# Altium schematic sheet autres_ressouces_schéma.SchDoc
size A3
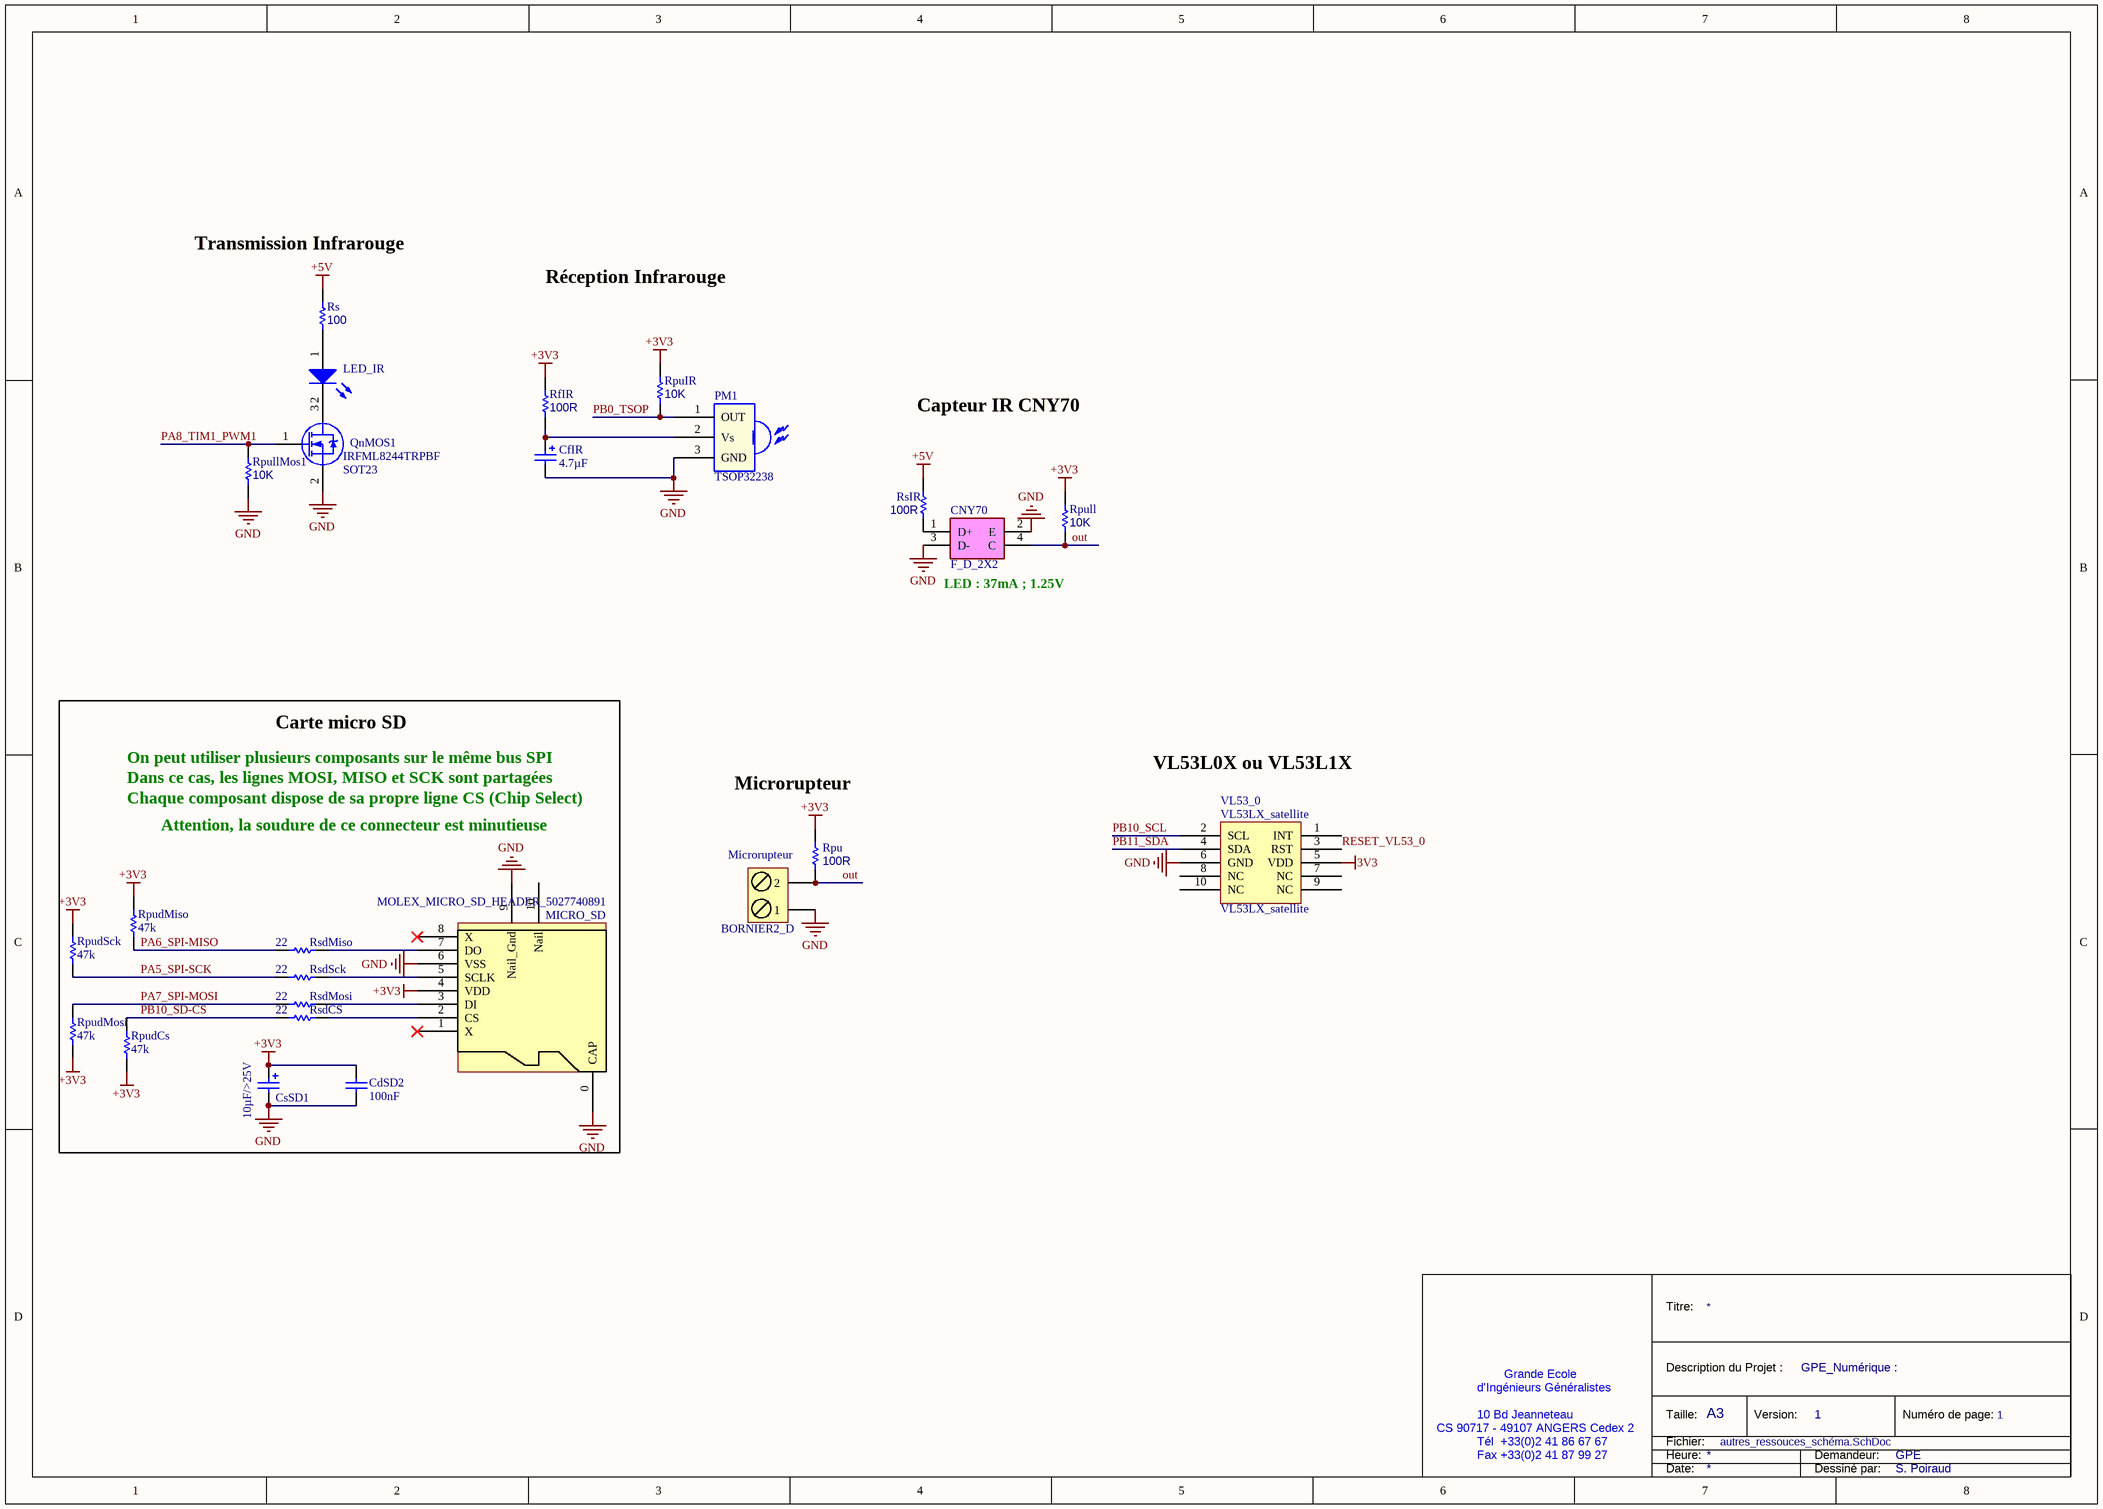
[diagram p0: autres_ressouces_schéma.SchDoc]

## Parts
CdSD2  100nF  [CONDENSATEUR_CERAMIQUE_RADIAL_5.08]
CfIR  value 4.7µF  [CONDENSATEUR_POLARISE_ELECTROLYTIQUE_RADIAL_2.0/5.08]  (hidden comment: CONDENSATEUR_POL_ELECTROLY_RAD_2.0/5.08)
CNY70  Type: F_D_2X2  [BARRETTE_2X2_F_D]  (hidden comment: BARRETTE 2 CONTACTS 2 RANGEES FEMELLE DROITE)
CsSD1  value 10µF/>25V  [CONDENSATEUR_POLARISE_ELECTROLYTIQUE_RADIAL_2.0/5.08]  (hidden comment: CONDENSATEUR_POL_ELECTROLY_RAD_2.0/5.08)
D2  Type: LED_IR  [LED_3MM]  (hidden comment: LED_3MM)
MICRO_SD  MOLEX_MICRO_SD_HEADER_5027740891  [MOLEX_MICRO_SD_HEADER_5027740891]
Microrupteur  Type: BORNIER2_D  [BORNIER2_A_VIS]  (hidden comment: BORNIER2 DROIT A VIS)
PM1  Type: TSOP32238  [RECEPTEUR_INFRAROUGE_TSOP32238]  (hidden comment: RECEPTEUR_INFRAROUGE_TSOP32238)
QnMOS1  Type: IRFML8244TRPBF  Package: SOT23  [TRANSISTOR_MOSFET-N_SOT23_GSD]  (hidden comment: TRANSISTOR_MOSFET-N_SOT23_GSD)
RfIR  value 100R  [RESISTANCE_1/4W]  (hidden comment: RESISTANCE_AXIALE_1/4W)
Rpu  value 100R  [RESISTANCE_1/4W]  (hidden comment: RESISTANCE_AXIALE_1/4W)
RpudCs  47k  [RESISTANCE_1/4W]
RpudMiso  47k  [RESISTANCE_1/4W]
RpudMosi  47k  [RESISTANCE_1/4W]
RpudSck  47k  [RESISTANCE_1/4W]
RpuIR  value 10K  [RESISTANCE_1/4W]  (hidden comment: RESISTANCE_AXIALE_1/4W)
Rpull  value 10K  [RESISTANCE_1/4W]  (hidden comment: RESISTANCE_AXIALE_1/4W)
RpullMos1  value 10K  [RESISTANCE_1/4W]  (hidden comment: RESISTANCE_AXIALE_1/4W)
Rs  value 100  [RESISTANCE_1/4W]  (hidden comment: RESISTANCE_AXIALE_1/4W)
RsdCS  22  [RESISTANCE_1/4W]
RsdMiso  22  [RESISTANCE_1/4W]
RsdMosi  22  [RESISTANCE_1/4W]
RsdSck  22  [RESISTANCE_1/4W]
RsIR  value 100R  [RESISTANCE_1/4W]  (hidden comment: RESISTANCE_AXIALE_1/4W)
VL53_0  VL53LX_satellite  [VL53LX - Satellite - HDR2x3]

## Blocks framed on the sheet
Carte micro SD: CdSD2 CsSD1 MICRO_SD RpudCs RpudMiso RpudMosi RpudSck RsdCS RsdMiso RsdMosi RsdSck

## Nets
3V3: VL53_0.5(VDD)
+3V3: CdSD2.2 CsSD1.1 MICRO_SD.4(VDD) RfIR.1 Rpu.1 RpudCs.1 RpudMiso.2 RpudMosi.1 RpudSck.2 RpuIR.1 Rpull.1
+5V: Rs.2 RsIR.1
GND: CdSD2.1 CfIR.2 CNY70.2(E) CNY70.3(D-) CsSD1.2 MICRO_SD.0(CAP) MICRO_SD.6(VSS) MICRO_SD.9(Nail_Gnd) Microrupteur.1 PM1.3(GND) QnMOS1.2(S) RpullMos1.1 VL53_0.6(GND)
out: CNY70.4(C) Microrupteur.2 Rpu.2 Rpull.2
PA5_SPI-SCK: RpudSck.1 RsdSck.1
PA6_SPI-MISO: RpudMiso.1 RsdMiso.1
PA7_SPI-MOSI: RpudMosi.2 RsdMosi.1
PA8_TIM1_PWM1: QnMOS1.1(G) RpullMos1.2
PB0_TSOP: PM1.1(OUT) RpuIR.2
PB10_SCL: VL53_0.2(SCL)
PB10_SD-CS: RpudCs.2 RsdCS.1
PB11_SDA: VL53_0.4(SDA)
RESET_VL53_0: VL53_0.3(RST)
NetCfIR_1: CfIR.1 PM1.2(Vs) RfIR.2
NetCNY70_1: CNY70.1(D+) RsIR.2
NetD2_1: D2.1 Rs.1
NetMICRO_SD_2: MICRO_SD.2(CS) RsdCS.2
NetMICRO_SD_3: MICRO_SD.3(DI) RsdMosi.2
NetMICRO_SD_5: MICRO_SD.5(SCLK) RsdSck.2
NetMICRO_SD_7: MICRO_SD.7(DO) RsdMiso.2

Not connected (* = marked no-connect by the designer): D2 2; MICRO_SD 1(X)* 8(X)* 10(Nail); QnMOS1 3(D); VL53_0 1(INT) 7(NC) 8(NC) 9(NC) 10(NC)

## Notes on the sheet
- (near Rs) Transmission Infrarouge
- Réception Infrarouge
- Capteur IR CNY70
- LED : 37mA ; 1.25V
- On peut utiliser plusieurs composants sur le même bus SPI
- Dans ce cas, les lignes MOSI, MISO et SCK sont partagées
- VL53L0X ou VL53L1X
- Chaque composant dispose de sa propre ligne CS (Chip Select)
- Attention, la soudure de ce connecteur est minutieuse
- (near Rpu) Microrupteur
- Titre:
- d'Ingénieurs Généralistes
- Grande Ecole
- Description du Projet :
- GPE_Numérique :
- CS 90717 - 49107 ANGERS Cedex 2
- 10 Bd Jeanneteau
- Tél  +33(0)2 41 86 67 67
- Fax +33(0)2 41 87 99 27
- Taille:
- Heure:
- Fichier:
- A3
- Version:
- 1
- Demandeur:
- GPE
- Numéro de page:
- Date:
- Dessiné par:
- S. Poiraud

## Library data of the parts
CdSD2 = Condensateur: Capacitor; Published: 8-Jun-2000; LatestRevisionDate: 17-Jul-2002; LatestRevisionNote: Re-released for DXP Platform.; PackageReference: RAD-0.3; Publisher: Altium Limited
CfIR CsSD1 = CONDENSATEUR_POL_ELECTROLY_RAD_2.0/5.08: CONDENSATEUR POLARISE ELECTROLYTIQUE RADIAL 2.0/5.08; Type: POL_RAD_2.0/5.08
CNY70 = BARRETTE_2 CONTACTS_2 RANGEES_FEMELLE_DROITE
D2 = LED_3MM: LED 3MM - ROUGE/VERTE/JAUNE
Microrupteur = BORNIER2_DROIT_A VIS: BORNIER 2 PLOTS DROIT A VIS 5.08mm
PM1 = RECEPTEUR_INFRAROUGE_TSOP32238_38kHz
QnMOS1 = TRANSISTOR_MOSFET-N_SOT23_GSD: TRANSISTOR MOSFET CANAL N BOITIER SOT23_GSD
RfIR Rpu RpuIR Rpull RpullMos1 Rs RsIR = RESISTANCE_AXIALE_1/4W: RESISTANCE TRAVERSANTE AXIALE 1/4W; Type: 1/4W
RpudCs RpudMiso RpudMosi RpudSck RsdCS RsdMiso RsdMosi RsdSck = Resistor: Published: 8-Jun-2000; LatestRevisionDate: 17-Jul-2002; LatestRevisionNote: Re-released for DXP Platform.; PackageReference: AXIAL-0.5; Publisher: Altium Limited